# EAGLE design DetectHeat_Board (EAGLE 6.5.0)
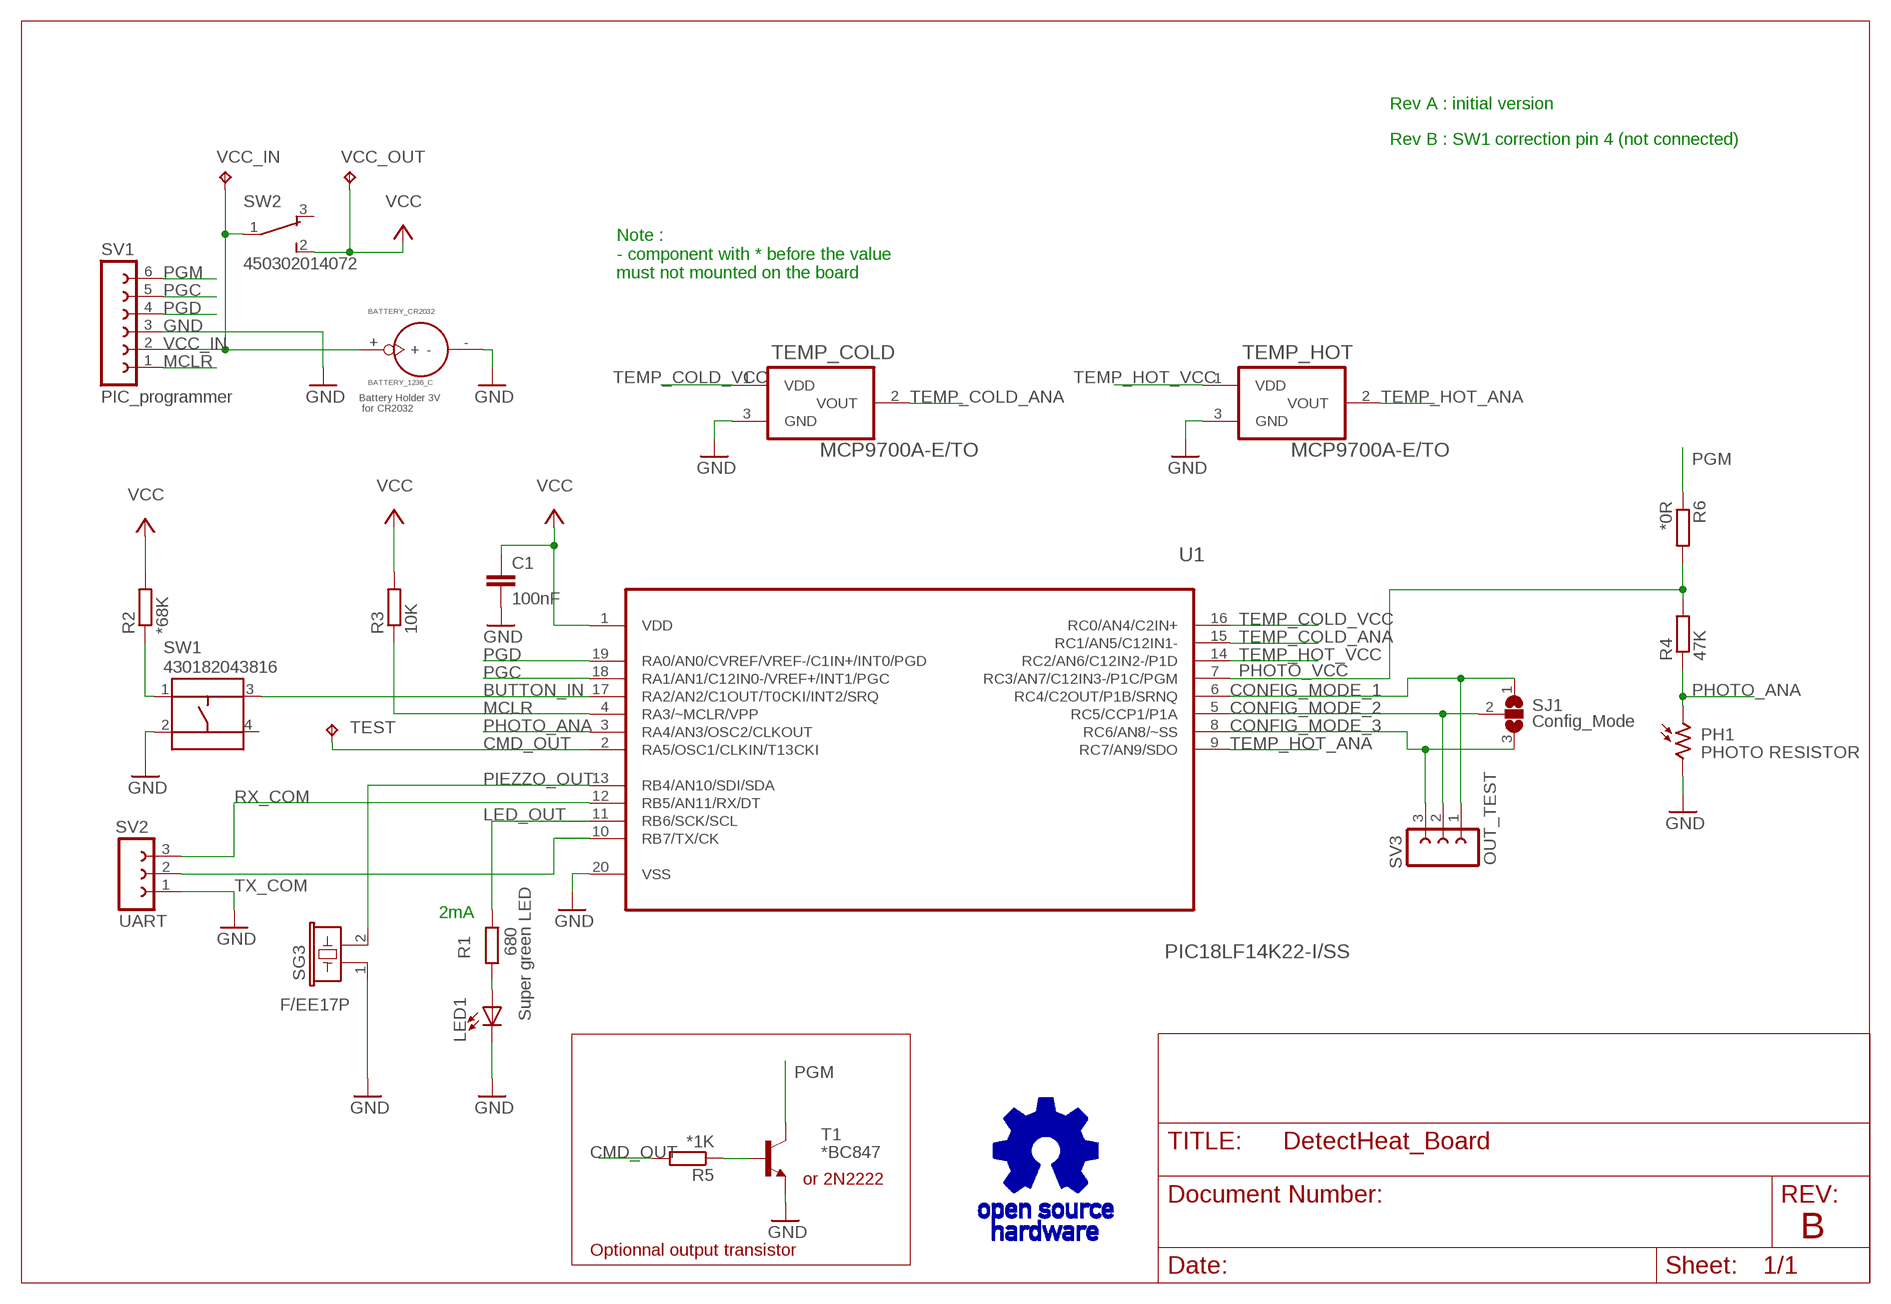
[diagram p0: schematic, sheet 1]

## Parts
BATTERY_CR2032  BATTERY_1236_C  [BATTERY_1236_C]
C1  100nF  C-EUC0805  [C0805]
LED1  Super green LED  LEDCHIPLED_0805  [CHIPLED_0805]
PH1  PHOTO RESISTOR  A1050_09  [T0-46-A10XX]
R1  680  R-EU_R0805  [R0805]
R2  *68K  R-EU_R0805  [R0805]
R3  10K  R-EU_R0805  [R0805]
R4  47K  R-EU_R0805  [R0805]
R5  *1K  R-EU_R0805  [R0805]
R6  *0R  R-EU_R0805  [R0805]
SG3  F/EE17P  [F/EE17P]
SJ1  Config_Mode  SJ2W  [SJ_2]
SV1  PIC_programmer  FE06-1  [FE06]
SV2  UART  FE03-1  [FE03-1]
SV3  OUT_TEST  FE03-1  [FE03-1]
SW1  430182043816  [430182043816]
SW2  450302014072  [450302014072]
T1  *BC847  BC847  [SOT23]
TEMP_COLD  MCP9700A-E/TO  [TO127P254X533-3]
TEMP_HOT  MCP9700A-E/TO  [TO127P254X533-3]
TEST  TPPAD1-13  [P1-13]
U1  PIC18LF14K22-I/SS  [SOP65P780X200-20N]
VCC_IN  TPPAD1-13  [P1-13]
VCC_OUT  TPPAD1-13  [P1-13]

## Nets
BUTTON_IN: SW1.3 U1.17(RA2/AN2/C1OUT/T0CKI/INT2/SRQ)
CMD_OUT: R5.2 TEST.TP U1.2(RA5/OSC1/CLKIN/T13CKI)
CONFIG_MODE_1: SJ1.1 SV3.1 U1.6(RC4/C2OUT/P1B/SRNQ)
CONFIG_MODE_2: SJ1.2 SV3.2 U1.5(RC5/CCP1/P1A)
CONFIG_MODE_3: SJ1.3 SV3.3 U1.8(RC6/AN8/~SS)
GND: BATTERY_CR2032.- C1.2 LED1.C PH1.2 SG3.1 SV1.3 SV2.1 SW1.2 T1.2(E) TEMP_COLD.3(GND) TEMP_HOT.3(GND) U1.20(VSS)
LED_OUT: R1.1 U1.11(RB6/SCK/SCL)
MCLR: R3.1 SV1.1 U1.4(RA3/~MCLR/VPP)
N$1: LED1.A R1.2
N$2: R5.1 T1.1(B)
N$3: R2.1 SW1.1
PGC: SV1.5 U1.18(RA1/AN1/C12IN0-/VREF+/INT1/PGC)
PGD: SV1.4 U1.19(RA0/AN0/CVREF/VREF-/C1IN+/INT0/PGD)
PGM: R6.1 SV1.6 T1.3(C)
PHOTO_ANA: PH1.1 R4.1 U1.3(RA4/AN3/OSC2/CLKOUT)
PHOTO_VCC: R4.2 R6.2 U1.7(RC3/AN7/C12IN3-/P1C/PGM)
PIEZZO_OUT: SG3.2 U1.13(RB4/AN10/SDI/SDA)
RX_COM: SV2.3 U1.12(RB5/AN11/RX/DT)
TEMP_COLD_ANA: TEMP_COLD.2(VOUT) U1.15(RC1/AN5/C12IN1-)
TEMP_COLD_VCC: TEMP_COLD.1(VDD) U1.16(RC0/AN4/C2IN+)
TEMP_HOT_ANA: TEMP_HOT.2(VOUT) U1.9(RC7/AN9/SDO)
TEMP_HOT_VCC: TEMP_HOT.1(VDD) U1.14(RC2/AN6/C12IN2-/P1D)
TX_COM: SV2.2 U1.10(RB7/TX/CK)
VCC: C1.1 R2.2 R3.2 SW2.2 U1.1(VDD) VCC_OUT.TP
VCC_IN: BATTERY_CR2032.+ SV1.2 SW2.1 VCC_IN.TP
Unconnected: SW1.4 SW2.3

## Notes on the sheet
- Rev A : initial version
- Rev B : SW1 correction pin 4 (not connected)
- Note :
  - component with * before the value
  must not mounted on the board
- Battery Holder 3V
   for CR2032
- 2mA
- or 2N2222
- B
- Optionnal output transistor

## Library data of the parts
BATTERY_CR2032 = Composants_Connectiques_Lib:BATTERY_1236_C: SOC004
C1 = resistor:C-EU: CAPACITOR, European symbol
LED1 = led:LED: LED OSRAM: - CHIPLED LG R971, LG N971, LY N971, LG Q971, LY Q971, LO R971, LY R971 LH N974, LH R974 LS Q976, LO Q976, LY Q976 LO Q996 - Hyper CHIPLED LW Q18S LB Q993, LB Q99A, LB R99A - SideLED LS A670, LO A670, LY A670, LG A670, LP A670 LB A673, LV A673, LT A673, LW A673 LH A674 LY A675 LS A676, LA A676, LO A676, LY A676, LW A676 LS A679, LY A679, LG A679 - Hyper Micro SIDELED® LS Y876, LA Y876, LO Y876, LY Y876 LT Y87S - SmartLED LW L88C, LW L88S LB L89C, LB L89S, LG L890 LS L89K, LO L89K, LY L89K LS L896, LA L896, LO L896, LY L896 - TOPLED LS T670, LO T670, LY T670, LG T670, LP T670 LSG T670, LSP T670, LSY T670, LOP T670, LYG T670 LG T671, LOG T671, LSG T671 LB T673, LV T673, LT T673, LW T673 LH T674 LS T676, LA T676, LO T676, LY T676, LB T676, LH T676, LSB T676, LW T676 LB T67C, LV T67C, LT T67C, LS T67K, LO T67K, LY T67K, LW E67C LS E67B, LA E67B, LO E67B, LY E67B, LB E67C, LV E67C, LT E67C LW T67C LS T679, LY T679, LG T679 LS T770, LO T770, LY T770, LG T770, LP T770 LB T773, LV T773, LT T773, LW T773 LH T774 LS E675, LA E675, LY E675, LS T675 LS T776, LA T776, LO T776, LY T776, LB T776 LHGB T686 LT T68C, LB T68C - Hyper Mini TOPLED® LB M676 - Mini TOPLED Santana® LG M470 LS M47K, LO M47K, LY M47K Source: http://www.osram.convergy.de LUXEON: - LUMILED® LXK2-PW12-R00, LXK2-PW12-S00, LXK2-PW14-U00, LXK2-PW14-V00 LXK2-PM12-R00, LXK2-PM12-S00, LXK2-PM14-U00 LXK2-PE12-Q00, LXK2-PE12-R00, LXK2-PE12-S00, LXK2-PE14-T00, LXK2-PE14-U00 LXK2-PB12-K00, LXK2-PB12-L00, LXK2-PB12-M00, LXK2-PB14-N00, LXK2-PB14-P00, LXK2-PB14-Q00 LXK2-PR12-L00, LXK2-PR12-M00, LXK2-PR14-Q00, LXK2-PR14-R00 LXK2-PD12-Q00, LXK2-PD12-R00, LXK2-PD12-S00 LXK2-PH12-R00, LXK2-PH12-S00 LXK2-PL12-P00, LXK2-PL12-Q00, LXK2-PL12-R00 Source: www.luxeon.com KINGBRIGHT: KA-3528ASYC Source: www.kingbright.com
PH1 = photo-elements:A10: Sensor Robust Light Sensing Applications Outdoor Light Sensing Application Source: http://optoelectronics.perkinelmer.com/content/Datasheets/DTS_PhotocellsA1050.pdf
R1-R6 = rcl:R-EU_: RESISTOR, European symbol
SG3 = buzzer:F/EE17P: BUZZER Source: Buerklin; OC_FARNELL: unknown; OC_NEWARK: unknown
SJ1 = jumper:SJ2W: SMD solder JUMPER
SV1 = con-lsta:FE06-1: FEMALE HEADER; OC_FARNELL: unknown; OC_NEWARK: unknown
SV2 SV3 = Composants_Connectiques_Lib:FE03-1: FEMALE HEADER; OC_FARNELL: unknown; OC_NEWARK: unknown
SW1 = Composants_Connectiques_Lib:430182043816: WS-TSS-6x6 mm SMD Tact Switch,4 pins
SW2 = Eagle_Wuerth_Elektronik_Switch_Power_Elements:450302014072: WS-SUT, 10mm*2.5mm, SPDT, ON-ON, 2.54mm, right angle type, THT, Mini Slide Switch, 3 pins
T1 = transistor:BC847: NPN TRANSISTOR
TEMP_COLD TEMP_HOT = Composants_Actif_Lib:MCP9700A-E/TO: THERMISTOR, LINEAR 10MV/C; MPN: MCP9700A-E/TO; OC_FARNELL: 1332164; OC_NEWARK: 17M0676; PACKAGE: TO-92-3; SUPPLIER: Microchip
TEST VCC_IN VCC_OUT = testpad_jc:TP: Test pad
U1 = Composants_Actif_Lib:PIC18LF14K22-I/SS: Flash Microcontrollers; MPN: PIC18LF14k22-I/SS; OC_FARNELL: 1770704; PACKAGE: SSOP-28; SUPPLIER: Microchip

## Board
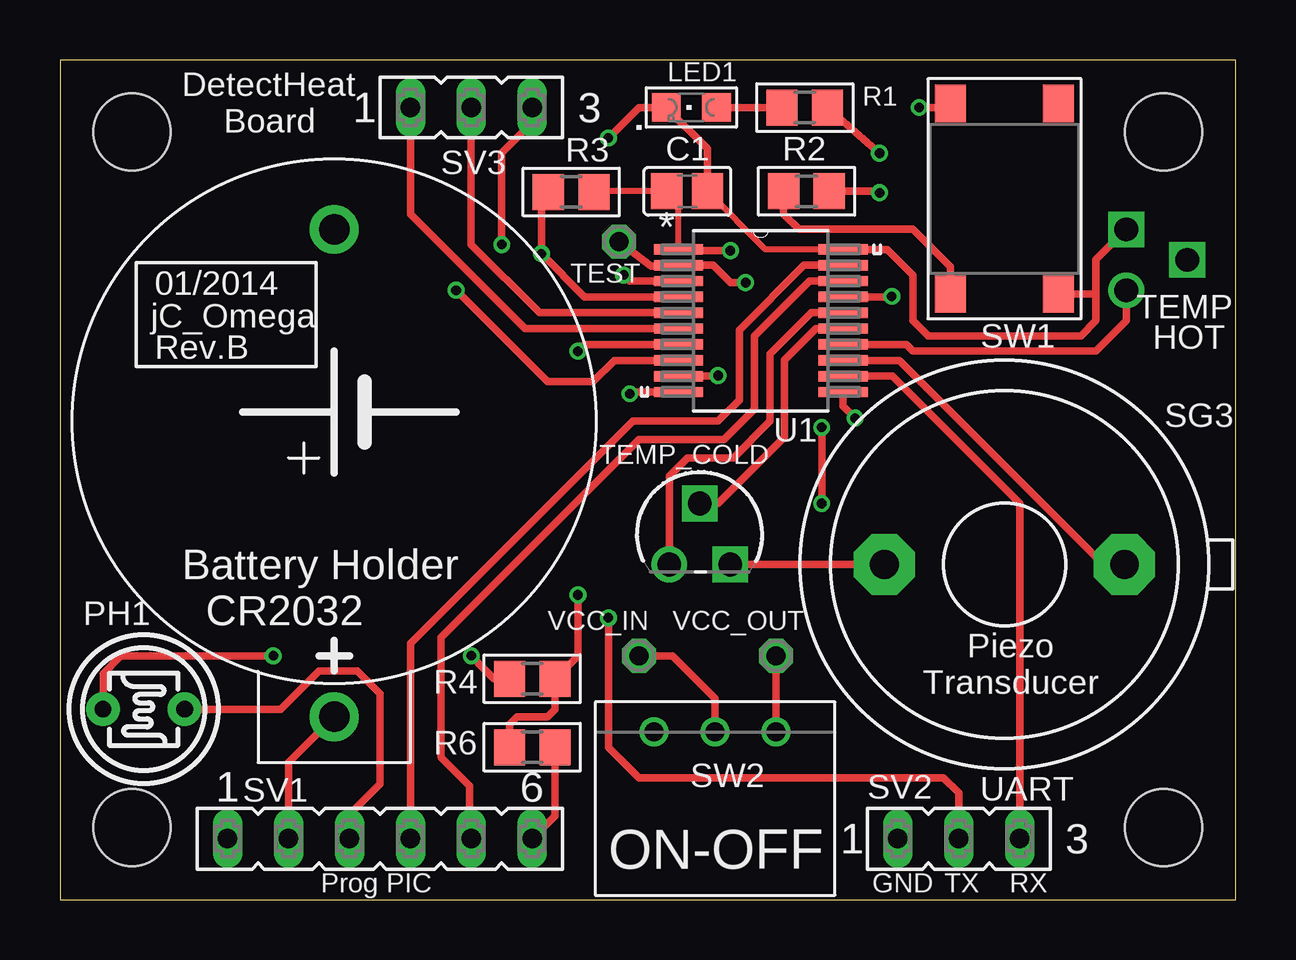
[diagram p1: board, top side]
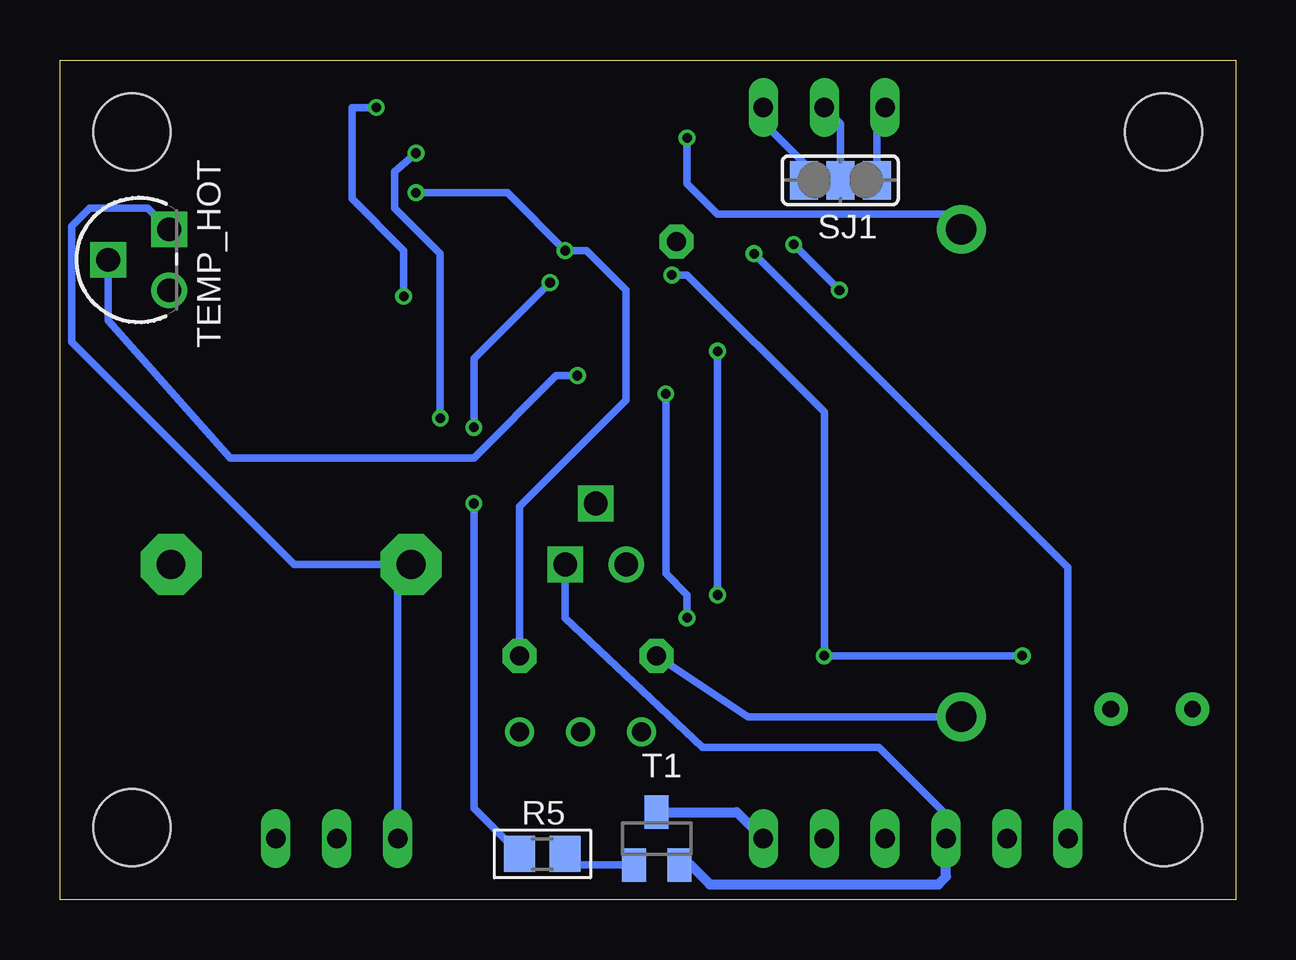
[diagram p2: board, bottom side, seen from below]

Size 49 x 35 mm. Coordinates in mm from the lower left corner, seen from the top.
Outline: 0,0 49,0 49,35 0,35 0,0
Copper layers (1*2*15*16): Top 0.035mm / dielectric 0.2mm / Route2 0.0175mm / dielectric 1.1mm / Route15 0.0175mm / dielectric 0.2mm / Bottom 0.035mm
Design rules "SeeedStudio_DRU_no_angle_20130527": minimum track width 6mil, minimum drill 12mil, track to track 6mil, track to pad 6mil, pad to pad 6mil, via to via 6mil, smd to smd 0mil, copper to edge 10mil, drill to drill 10mil, minimum pad ring 6mil, minimum via ring 6mil, stop-mask expansion 2mil, vias tented up to drill 25mil, thermal gap 10mil
Holes 3.2 mm at 3,32 46,32 3,3 46,3

### Footprints (pad centres in the part's own frame; a part is rotated, then mirrored left to right if it is on the bottom)
BATTERY_1236_C = drill 1.27 pad 2.032: + 0,0; - 0,20.32
C0805 = smd 1.3 x 1.5: 1 -0.85,0; 2 0.85,0
CHIPLED_0805 = smd 1.2 x 1.2: A 0,-1.05; C 0,1.05
T0-46-A10XX = drill 0.7 pad 1.4: 1 -1.7,0; 2 1.7,0
R0805 = smd 1.3 x 1.5: 1 -0.95,0; 2 0.95,0
F/EE17P = drill 1.194 pad 2.54 octagon: 1 -5.004,0; 2 5.004,0
SJ_2 = smd 1.168 x 1.6: 1 -1.524,0; 2 0,0; 3 1.524,0
FE06 = drill 0.813 long: 1 -6.35,0; 2 -3.81,0; 3 -1.27,0; 4 1.27,0; 5 3.81,0; 6 6.35,0
FE03-1 = drill 0.813 long: 1 -5.08,0; 2 -2.54,0; 3 0,0
430182043816 = smd 1.55 x 1.3: 1 -3.975,2.25; 2 -3.975,-2.25; 3 3.975,2.25; 4 3.975,-2.25
450302014072 = drill 0.8: 1 0,0; 2 -2.54,0; 3 2.54,0
SOT23 = smd 1 x 1.4: 1 -0.95,-1.1; 2 0.95,-1.1; 3 0,1.1
TO127P254X533-3 = drill 0.991: 1 -2.54,-2.54 | drill 0.991 square: 2 -1.27,0; 3 0,-2.54
P1-13 = drill 0.8 pad 1.422 octagon: TP 0,0
SOP65P780X200-20N = smd 2.057 x 0.432: 1 -3.429,2.972; 2 -3.429,2.311; 3 -3.429,1.651; 4 -3.429,0.991; 5 -3.429,0.33; 6 -3.429,-0.33; 7 -3.429,-0.991; 8 -3.429,-1.651; 9 -3.429,-2.311; 10 -3.429,-2.972; 11 3.429,-2.972; 12 3.429,-2.311; 13 3.429,-1.651; 14 3.429,-0.991; 15 3.429,-0.33; 16 3.429,0.33; 17 3.429,0.991; 18 3.429,1.651; 19 3.429,2.311; 20 3.429,2.972

### Placement (x,y rotation side)
BATTERY_CR2032  11.43,7.62 0 top
C1  26.14,29.53 0 top
LED1  26.32,33.02 90 top
PH1  3.49,7.94 0 top
R1  31.05,33.02 180 top
R2  31.11,29.53 0 top
R3  21.31,29.5 0 top
R4  19.68,9.21 0 top
R5  28.89,1.91 180 bottom
R6  19.68,6.35 180 top
SG3  39.37,13.97 0 top
SJ1  16.47,29.98 180 bottom
SV1  13.34,2.54 0 top
SV2  40.01,2.54 0 top
SV3  19.68,33.02 0 top
SW1  39.37,29.21 90 top
SW2  27.3,6.99 180 top
T1  24.13,2.54 0 bottom
TEMP_COLD  27.94,16.51 0 top
TEMP_HOT  46.99,27.94 90 bottom
TEST  23.3,27.43 0 top
U1  29.21,24.13 0 top
VCC_IN  24.13,10.16 0 top
VCC_OUT  29.84,10.16 0 top

### Tracks (layer width: path | path; a pad name or v marks a point on that pad's centre or on a via)
BUTTON_IN  (via drill 0.4)
  Top 0.305: U1.17 34.65,25.12 v34.67,25.15 | v35.81,33.02 36.95,33.02 SW1.3
  Bottom 0.305: v34.67,25.15 34.67,27.05 36.83,29.21 36.83,33.02 v35.81,33.02
CMD_OUT  (via drill 0.4)
  Top 0.305: TEST.TP 24.64,26.42 25.76,26.42 U1.2 27.22,26.44 27.94,25.72 v28.57,25.72 | v31.75,16.51 v31.75,19.68
  Bottom 0.305: R5.2 31.75,3.81 v31.75,16.51 | v31.75,19.68 31.75,22.54 v28.57,25.72
CONFIG_MODE_1
  Top 0.305: U1.6 19.38,23.8 14.61,28.57 SV3.1
  Bottom 0.305: SJ1.1 14.95,32.68 SV3.1
CONFIG_MODE_2
  Top 0.305: U1.5 19.99,24.46 17.14,27.3 SV3.2
  Bottom 0.305: SJ1.2 16.47,32.35 SV3.2
CONFIG_MODE_3  (via drill 0.4)
  Top 0.305: U1.8 23.11,22.48 22.23,21.59 20.32,21.59 v16.51,25.4 | v18.41,27.3 18.41,31.11 19.68,32.38 SV3.3
  Bottom 0.305: SJ1.3 18,30.7 19.68,32.38 SV3.3 | v16.51,25.4 v18.41,27.3
GND  (via drill 0.4)
  Top 0.254: U1.20 29.42,27.1 C1.2
  Top 0.305: C1.2 26.99,31.11 26.99,31.3 LED1.C 24.13,33.02 v22.86,31.75 | TEMP_HOT.3 43.18,26.67 43.18,25.23 | U1.20 34.49,27.1 35.56,26.04 35.56,24.13 36.2,23.5 42.55,23.5 43.18,24.13 43.18,24.89 43.18,25.23 | TEMP_COLD.3 SG3.1 | PH1.2 9.21,7.94 10.79,9.53 12.38,9.53 13.34,8.57 13.34,4.83 12.06,3.56 SV1.3 | SW1.2 43.18,25.23
  Bottom 0.305: TEMP_COLD.3 27.94,11.75 22.23,6.35 14.86,6.35 12.06,3.56 SV1.3 | BATTERY_CR2032.- 12.06,28.57 21.59,28.57 22.86,29.84 v22.86,31.75 | SV2.1 34.92,13.41 SG3.1 39.24,13.97 48.51,23.24 48.51,28.07 47.75,28.83 45.34,28.83 TEMP_HOT.3 | T1.2 22.71,1.44
  Bottom 0.406: 22.71,1.44 21.91,0.64 12.38,0.64 12.06,0.95 SV1.3
LED_OUT  (via drill 0.4)
  Top 0.305: U1.11 32.64,20.57 v33.15,20.07 | v34.16,31.11 R1.1
  Bottom 0.305: v33.15,20.07 33.15,26.92 35.05,28.83 35.05,30.35 v34.16,31.11
MCLR  (via drill 0.4)
  Top 0.305: U1.4 21.87,25.12 v20.07,26.92 20.07,29.47 R3.1
  Bottom 0.305: SV1.1 6.99,13.84 v20.07,26.92
N$1
  Top 0.305: LED1.A R1.2
N$2
  Bottom 0.305: T1.1 27.48,1.44 R5.1
N$3
  Top 0.305: SW1.1 37.12,26.38 35.56,27.94 30.8,27.94 30.16,28.57 R2.1
PGC
  Top 0.305: U1.18 31.24,25.78 28.96,23.5 28.96,20.45 27.69,19.18 24.13,19.18 15.88,10.92 15.88,5.93 17.06,4.74 17.06,2.54 SV1.5
PGD
  Top 0.305: U1.19 31.01,26.44 28.32,23.75 28.32,20.83 27.43,19.94 23.88,19.94 14.61,10.67 SV1.4
PGM
  Top 0.305: SV1.6 20.64,3.5 R6.1
  Bottom 0.406: T1.3 20.79,3.64 SV1.6
PHOTO_ANA  (via drill 0.4 pad 0.61)
  Top 0.305: U1.3 23.75,25.78 v23.5,26.04 | PH1.1 1.79,9.41 2.54,10.16 v8.89,10.16 | R4.1 18.1,9.21 v17.14,10.16
  Bottom 0.305: v23.5,26.04 22.86,26.04 17.14,20.32 v17.14,10.16 v8.89,10.16
PHOTO_VCC  (via drill 0.4)
  Top 0.305: R6.2 18.73,7.3 19.05,7.62 20.32,7.62 20.64,7.94 R4.2 21.59,10.16 v21.59,12.7 | U1.7 21.87,23.14 v21.59,22.86
  Bottom 0.305: v21.59,22.86 v21.59,12.7
PIEZZO_OUT
  Top 0.305: U1.13 34.99,22.48 43.5,13.97 SG3.2
RX_COM
  Top 0.305: U1.12 34.7,21.82 40.01,16.51 SV2.3
TEMP_COLD_ANA
  Top 0.305: U1.15 31.51,23.8 30.21,22.5 30.21,19.29 27.43,16.51 TEMP_COLD.2
TEMP_COLD_VCC
  Top 0.305: U1.16 31.32,24.46 29.59,22.73 29.59,19.94 28.07,18.41 26.16,18.41 25.4,17.65 TEMP_COLD.1
TEMP_HOT_ANA  (via drill 0.4)
  Top 0.305: U1.9 27.41,21.82 v27.43,21.84
  Bottom 0.305: v27.43,21.84 28.32,21.84 31.75,18.41 41.91,18.41 46.99,24.13 TEMP_HOT.2
TEMP_HOT_VCC
  Top 0.305: TEMP_HOT.1 44.45,24.13 43.18,22.86 35.56,22.86 35.28,23.14 U1.14
TX_COM  (via drill 0.4)
  Top 0.305: U1.10 23.82,21.16 v23.75,21.08 | v22.86,11.75 22.86,6.35 24.13,5.08 36.83,5.08 37.47,4.45 SV2.2
  Bottom 0.305: v23.75,21.08 23.75,13.59 22.86,12.7 v22.86,11.75
VCC  (via drill 0.4)
  Top 0.254: U1.1 25.78,29.04 C1.1 21.97,29.53 R3.2
  Top 0.305: R2.2 34.1,29.53 v34.16,29.46 | v27.94,27.05 25.83,27.05 U1.1 | SW2.2 VCC_OUT.TP
  Bottom 0.305: v34.16,29.46 30.35,29.46 v27.94,27.05 27.05,27.05 25.4,25.4 25.4,20.83 29.84,16.38 VCC_OUT.TP
VCC_IN
  Top 0.305: SV1.2 9.53,5.71 BATTERY_CR2032.+ | VCC_IN.TP 25.53,10.16 27.3,8.38 SW2.1
  Bottom 0.305: BATTERY_CR2032.+ 20.32,7.62 VCC_IN.TP

### Text on the board
tNames: DetectHeat | Board | 01/2014 | jC_Omega | TEMP | HOT | Rev.B | Piezo / Transducer | UART | ON-OFF | Prog PIC | GND | TX | RX